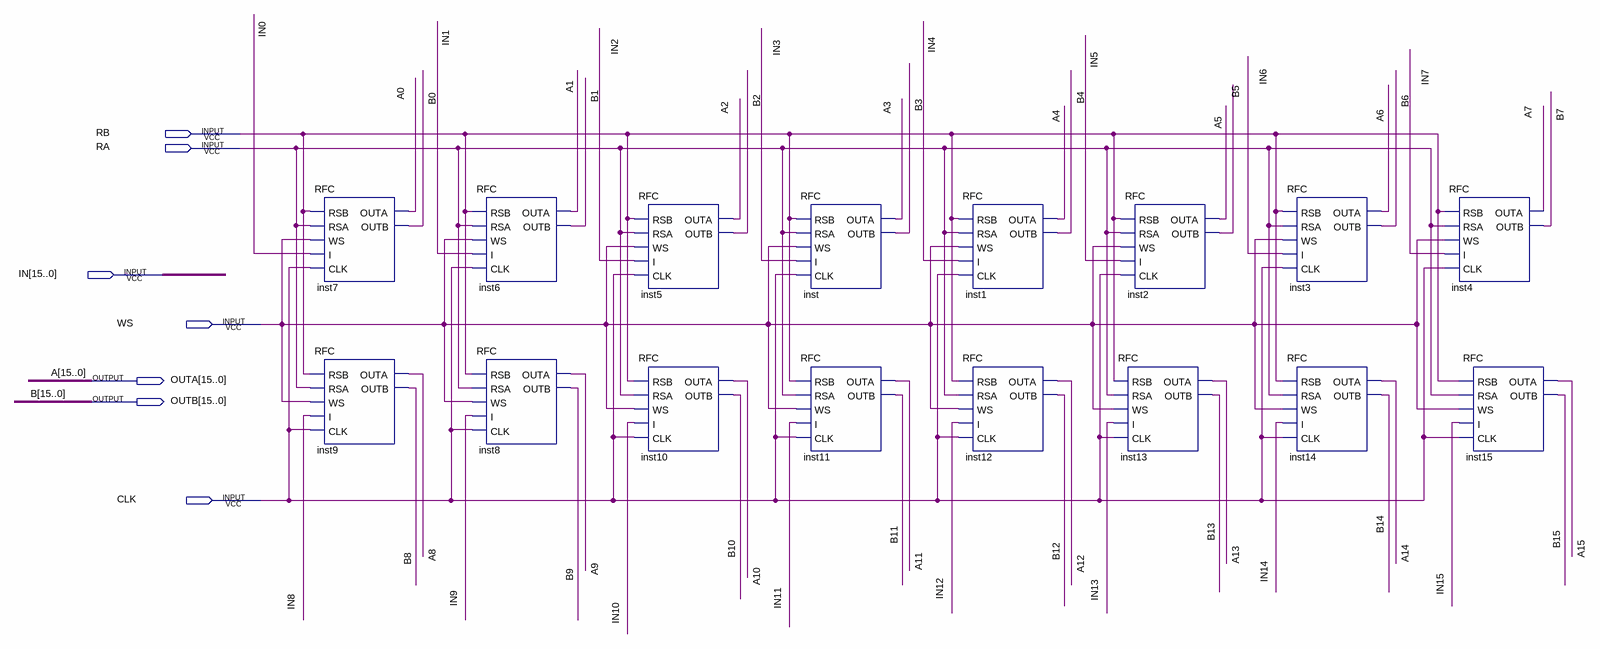
[diagram p0: schematic sheet]
// Quartus schematic RFC8x16.bdf as structural Verilog: 16 symbols, 7 pins
module RFC8x16 (
  input  RB,
  input  RA,
  input  [15:0] IN,
  input  WS,
  input  CLK,
  output [15:0] OUTA,
  output [15:0] OUTB
);

  RFC inst7 (.RSB(RB), .RSA(RA), .WS(WS), .I(IN[0]), .CLK(CLK), .OUTA(OUTA[0]), .OUTB(OUTB[0]));
  RFC inst9 (.RSB(RB), .RSA(RA), .WS(WS), .I(IN[8]), .CLK(CLK), .OUTA(OUTA[8]), .OUTB(OUTB[8]));
  RFC inst6 (.RSB(RB), .RSA(RA), .WS(WS), .I(IN[1]), .CLK(CLK), .OUTA(OUTA[1]), .OUTB(OUTB[1]));
  RFC inst8 (.RSB(RB), .RSA(RA), .WS(WS), .I(IN[9]), .CLK(CLK), .OUTA(OUTA[9]), .OUTB(OUTB[9]));
  RFC inst5 (.RSB(RB), .RSA(RA), .WS(WS), .I(IN[2]), .CLK(CLK), .OUTA(OUTA[2]), .OUTB(OUTB[2]));
  RFC inst10 (.RSB(RB), .RSA(RA), .WS(WS), .I(IN[10]), .CLK(CLK), .OUTA(OUTA[10]), .OUTB(OUTB[10]));
  RFC inst (.RSB(RB), .RSA(RA), .WS(WS), .I(IN[3]), .CLK(CLK), .OUTA(OUTA[3]), .OUTB(OUTB[3]));
  RFC inst11 (.RSB(RB), .RSA(RA), .WS(WS), .I(IN[11]), .CLK(CLK), .OUTA(OUTA[11]), .OUTB(OUTB[11]));
  RFC inst1 (.RSB(RB), .RSA(RA), .WS(WS), .I(IN[4]), .CLK(CLK), .OUTA(OUTA[4]), .OUTB(OUTB[4]));
  RFC inst12 (.RSB(RB), .RSA(RA), .WS(WS), .I(IN[12]), .CLK(CLK), .OUTA(OUTA[12]), .OUTB(OUTB[12]));
  RFC inst2 (.RSB(RB), .RSA(RA), .WS(WS), .I(IN[5]), .CLK(CLK), .OUTA(OUTA[5]), .OUTB(OUTB[5]));
  RFC inst13 (.RSB(RB), .RSA(RA), .WS(WS), .I(IN[13]), .CLK(CLK), .OUTA(OUTA[13]), .OUTB(OUTB[13]));
  RFC inst3 (.RSB(RB), .RSA(RA), .WS(WS), .I(IN[6]), .CLK(CLK), .OUTA(OUTA[6]), .OUTB(OUTB[6]));
  RFC inst14 (.RSB(RB), .RSA(RA), .WS(WS), .I(IN[14]), .CLK(CLK), .OUTA(OUTA[14]), .OUTB(OUTB[14]));
  RFC inst4 (.RSB(RB), .RSA(RA), .WS(WS), .I(IN[7]), .CLK(CLK), .OUTA(OUTA[7]), .OUTB(OUTB[7]));
  RFC inst15 (.RSB(RB), .RSA(RA), .WS(WS), .I(IN[15]), .CLK(CLK), .OUTA(OUTA[15]), .OUTB(OUTB[15]));

  // Other names for the same wires on the sheet: A[15:0] = OUTA; A0 = OUTA[0]; A1 = OUTA[1]; A2 = OUTA[2];
  //   A3 = OUTA[3]; A4 = OUTA[4]; A5 = OUTA[5]; A6 = OUTA[6]; A7 = OUTA[7]; A8 = OUTA[8]; A9 = OUTA[9];
  //   A10 = OUTA[10]; A11 = OUTA[11]; A12 = OUTA[12]; A13 = OUTA[13]; A14 = OUTA[14]; A15 = OUTA[15]; B[15:0] = OUTB;
  //   B0 = OUTB[0]; B1 = OUTB[1]; B2 = OUTB[2]; B3 = OUTB[3]; B4 = OUTB[4]; B5 = OUTB[5]; B6 = OUTB[6]; B7 = OUTB[7];
  //   B8 = OUTB[8]; B9 = OUTB[9]; B10 = OUTB[10]; B11 = OUTB[11]; B12 = OUTB[12]; B13 = OUTB[13]; B14 = OUTB[14];
  //   B15 = OUTB[15]
endmodule
